# EAGLE design LAMEBOY (EAGLE 7.6.0)

## Sheet 1 of 2
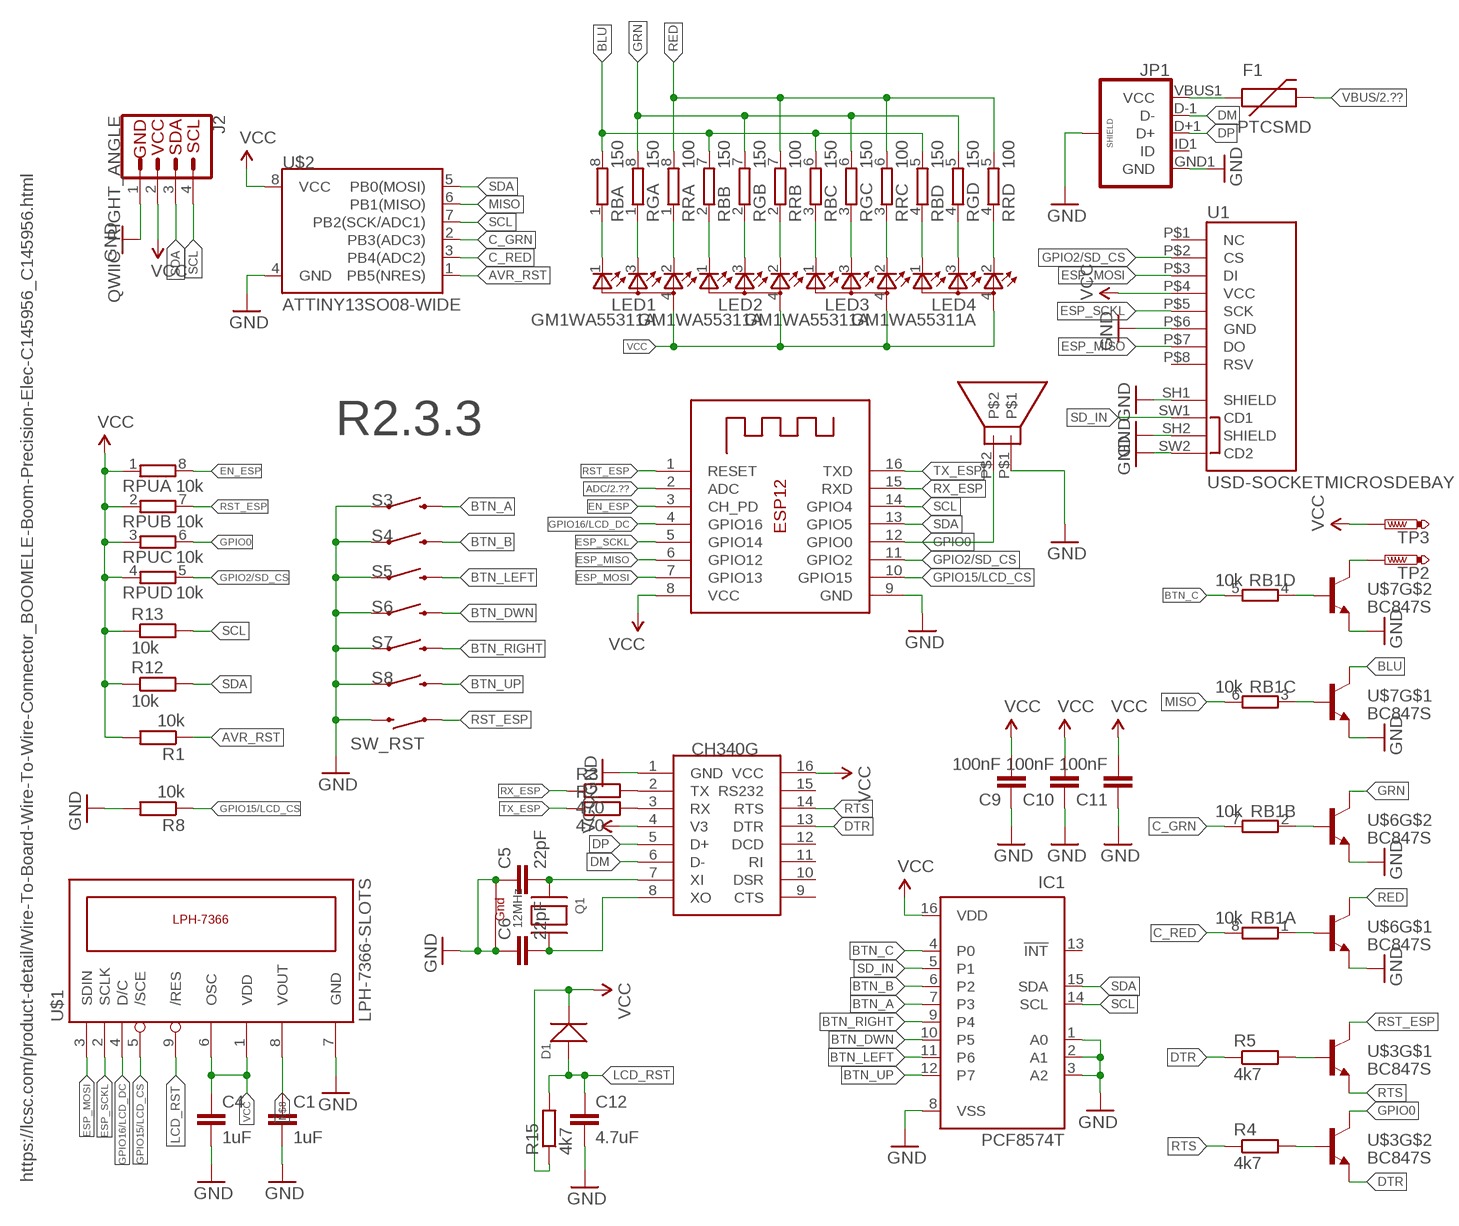
[diagram p0: schematic, sheet 1]

### Parts
C1  1uF  C-EUC0805  [C0805]
C4  1uF  C-EUC0805  [C0805]
C5  22pF  C-EUC0805  [C0805]
C6  22pF  C-EUC0805  [C0805]
C9  100nF  C-EUC0805  [C0805]
C10  100nF  C-EUC0805  [C0805]
C11  100nF  C-EUC0805  [C0805]
C12  4.7uF  C-EUC0805  [C0805]
CH340G  CH340GCH340G  [SOIC16]
D1  DIODE'1N4148-SMD'  [LL-34]
F1  PTCSMD  [PTC-1206]
IC1  PCF8574T  [SO16W]
J2  QWIIC_RIGHT_ANGLE  QWIIC_CONNECTORJS-1MM  [JST04_1MM_RA]
JP1  USB_MICROB_PLUG-IDK  [USB-AB-MICRO-SMD_SLOT]
LED1  GM1WA55311A  [GM1WA55311A]
LED2  GM1WA55311A  [GM1WA55311A]
LED3  GM1WA55311A  [GM1WA55311A]
LED4  GM1WA55311A  [GM1WA55311A]
Q1  12MHz  XTAL-4BIGGER  [NX3225_BIGGER]
R1  10k  R-EU_R0603  [R0603]
R2  470  R-EU_R0603  [R0603]
R3  470  R-EU_R0603  [R0603]
R4  4k7  R-EU_R0603  [R0603]
R5  4k7  R-EU_R0603  [R0603]
R8  10k  R-EU_R0603  [R0603]
R12  10k  R-EU_R0603  [R0603]
R13  10k  R-EU_R0603  [R0603]
R15  4k7  R-EU_R0603  [R0603]
RB  150  4R-N0603-ARC  [0603-ARC]
RB1  10k  4R-N0603-ARC  [0603-ARC]
RG  150  4R-N0603-ARC  [0603-ARC]
RPU  10k  4R-N0603-ARC  [0603-ARC]
RR  100  4R-N0603-ARC  [0603-ARC]
S3  SWITCH-MOMENTARY-2SMD-4  [TACTILE_SWITCH_TALL]
S4  SWITCH-MOMENTARY-2SMD-4  [TACTILE_SWITCH_TALL]
S5  SWITCH-MOMENTARY-2SMD-4  [TACTILE_SWITCH_TALL]
S6  SWITCH-MOMENTARY-2SMD-4  [TACTILE_SWITCH_TALL]
S7  SWITCH-MOMENTARY-2SMD-4  [TACTILE_SWITCH_TALL]
S8  SWITCH-MOMENTARY-2SMD-4  [TACTILE_SWITCH_TALL]
SW_RST  SWITCH-MOMENTARY-2-SMD-1101NE  [TACTILE-SWITCH-1101NE]
TP2  PTR1B1,27  [B1,27]
TP3  PTR1B1,27  [B1,27]
U1  USD-SOCKETMICROSDEBAY  [MICRO-SD-SOCKET-EBAY]
U$1  LPH-7366-SLOTS  [LPH-7366-SLOTS]
U$2  ATTINY13SO08-WIDE  [SO08-EIAJ]
U$3  BC847S  MMDT3904  [SOT363]
U$5  SPEAKERKMTG-1102  [KMTG-1102]
U$6  BC847S  MMDT3904  [SOT363]
U$7  BC847S  MMDT3904  [SOT363]
X1  ESP-12  [ESP-12]

### Nets
ADC: X1.2(ADC) ; also sheet 2
AVR_RST: R1.1 U$2.1(PB5(NRES))
BLU: RB.5 RB.6 RB.7 RB.8 U$7.3(C)
BLUE_LED: LED4.1(CGREEN) RB.4
BTN_A: IC1.7(P3) S3.B2
BTN_B: IC1.6(P2) S4.B2
BTN_C: IC1.4(P0) RB1.5
BTN_DWN: IC1.10(P5) S6.B2
BTN_LEFT: IC1.11(P6) S5.B2
BTN_RIGHT: IC1.9(P4) S7.B2
BTN_UP: IC1.12(P7) S8.B2
C_GRN: RB1.7 U$2.2(PB3(ADC3))
C_RED: RB1.8 U$2.3(PB4(ADC2))
DM: CH340G.6(D-) JP1.D-1(D-)
DP: CH340G.5(D+) JP1.D+1(D+)
DTR: CH340G.13(DTR) R5.1 U$3.1(E)
EN_ESP: RPU.8 X1.3(CH_PD)
ESP_MISO: U1.P$7(DO) X1.6(GPIO12)
ESP_MOSI: U1.P$3(DI) U$1.3(SDIN) X1.7(GPIO13)
ESP_SCKL: U1.P$5(SCK) U$1.2(SCLK) X1.5(GPIO14)
GND: C1.2 C4.2 C5.1 C6.1 C9.1 C10.1 C11.1 C12.2 CH340G.1(GND) IC1.1(A0) IC1.2(A1) IC1.3(A2) IC1.8(VSS) J2.1 JP1.GND1(GND) JP1.P$1(SHIELD) JP1.P$2(SHIELD) JP1.P$3(SHIELD) JP1.P$4(SHIELD) Q1.2(G2) Q1.4(G1) R8.2 S3.A2 S4.A2 S5.A2 S6.A2 S7.A2 S8.A2 SW_RST.P$2 U1.P$6(GND) U1.SH1(SHIELD) U1.SH2(SHIELD) U1.SW2(CD2) U$1.7(GND) U$2.4(GND) U$5.P$1 U$6.1(E) U$6.4(E) U$7.1(E) U$7.4(E) X1.9(GND) ; also sheet 2
GPIO0: RPU.6 U$3.6(C) U$5.P$2 X1.12(GPIO0)
GPIO2/SD_CS: RPU.5 U1.P$2(CS) X1.11(GPIO2)
GPIO15/LCD_CS: R8.1 U$1.5(/SCE) X1.10(GPIO15)
GPIO16/LCD_DC: U$1.4(D/C) X1.4(GPIO16)
GREEN_LED: LED4.3(CBLUE) RG.4
GRN: RG.5 RG.6 RG.7 RG.8 U$6.6(C)
L2_R: LED1.3(CBLUE) RG.1
L3_B: LED1.1(CGREEN) RB.1
L4_G: LED1.2(CRED) RR.1
LCD_RST: C12.1 D1.A(+) R15.2 U$1.9(/RES)
MISO: RB1.6 U$2.6(PB1(MISO))
N$4: LED3.1(CGREEN) RB.3
N$5: LED3.3(CBLUE) RG.3
N$6: LED3.2(CRED) RR.3
N$7: LED2.1(CGREEN) RB.2
N$8: C1.1 U$1.8(VOUT)
N$9: LED2.3(CBLUE) RG.2
N$10: LED2.2(CRED) RR.2
N$11: RB1.1 U$6.5(B)
N$13: RB1.2 U$6.2(B)
N$16: TP2.TP U$7.6(C)
N$17: C5.2 CH340G.7(XI) Q1.1(X1)
N$18: RB1.3 U$7.5(B)
N$19: RB1.4 U$7.2(B)
N$24: C6.2 CH340G.8(XO) Q1.3(X2)
N$25: R5.2 U$3.5(B)
N$26: CH340G.3(RX) R2.2
N$27: CH340G.2(TX) R3.2
N$28: R4.2 U$3.2(B)
RED: RR.5 RR.6 RR.7 RR.8 U$6.3(C)
RED_LED: LED4.2(CRED) RR.4
RST_ESP: RPU.7 SW_RST.P$1 U$3.3(C) X1.1(RESET)
RTS: CH340G.14(RTS) R4.1 U$3.4(E)
RX_ESP: R3.1 X1.15(RXD)
SCL: IC1.14(SCL) J2.4 R13.2 U$2.7(PB2(SCK/ADC1)) X1.14(GPIO4)
SD_IN: IC1.5(P1) U1.SW1(CD1)
SDA: IC1.15(SDA) J2.3 R12.2 U$2.5(PB0(MOSI)) X1.13(GPIO5)
TX_ESP: R2.1 X1.16(TXD)
VBUS: F1.2 ; also sheet 2
VCC: C4.1 C9.2 C10.2 C11.2 CH340G.4(V3) CH340G.16(VCC) D1.C(-) IC1.16(VDD) J2.2 LED1.4(A) LED2.4(A) LED3.4(A) LED4.4(A) R1.2 R12.1 R13.1 R15.1 RPU.1 RPU.2 RPU.3 RPU.4 TP3.TP U1.P$4(VCC) U$1.1(VDD) U$1.6(OSC) U$2.8(VCC) X1.8(VCC) ; also sheet 2
VUSB: F1.1 JP1.VBUS1(VCC)
Unconnected: CH340G.9(CTS) CH340G.10(DSR) CH340G.11(RI) CH340G.12(DCD) CH340G.15(RS232) IC1.13(!INT) JP1.ID1(ID) U1.P$1(NC) U1.P$8(RSV)

### Notes on the sheet
- R2.3.3
- https://lcsc.com/product-detail/Wire-To-Board-Wire-To-Wire-Connector_BOOMELE-Boom-Precision-Elec-C145956_C145956.html

## Sheet 2 of 2
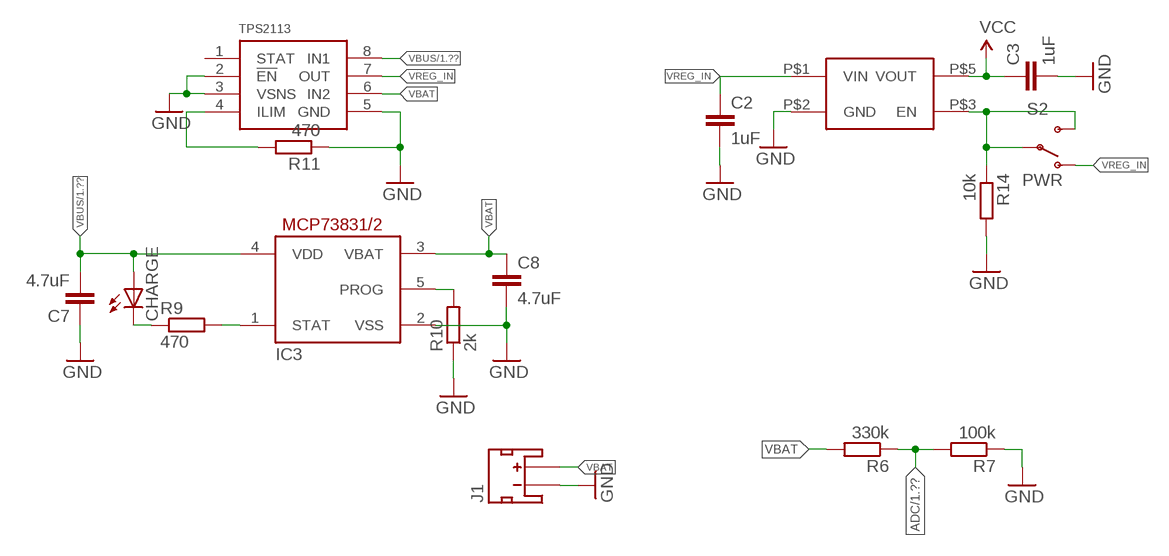
[diagram p1: schematic, sheet 2]

### Parts
C2  1uF  C-EUC0805  [C0805]
C3  1uF  C-EUC0805  [C0805]
C7  4.7uF  C-EUC0805  [C0805]
C8  4.7uF  C-EUC0805  [C0805]
CHARGE  LEDCHARLIE  [CHIPLED_0603_CHARLIE]
IC3  MCP73831  MCP73831/OT  [SOT23-5L]
J1  JST_2MM_MALE  [JST-2-SMD]
R6  330k  R-EU_R0603  [R0603]
R7  100k  R-EU_R0603  [R0603]
R9  470  R-EU_R0603  [R0603]
R10  2k  R-EU_R0603  [R0603]
R11  470  R-EU_R0603  [R0603]
R14  10k  R-EU_R0603  [R0603]
S2  PWR  SWITCH-SPDT-SMD-A  [SWITCH-SPST-SMD-A]
U$4  TPS2113-PW  [TEXAS-PW]
U$9  AP2112KAP2112K  [AP2112]

### Nets
ADC: R6.1 R7.2 ; also sheet 1
GND: C2.2 C3.2 C7.1 C8.2 IC3.2(VSS) J1.1(-) R7.1 R10.1 R11.1 R14.2 U$4.2(!EN) U$4.3(VSNS) U$4.5(GND) U$9.P$2(GND) ; also sheet 1
N$12: IC3.1(STAT) R9.2
N$15: CHARGE.C R9.1
N$20: R11.2 U$4.4(ILIM)
N$21: IC3.5(PROG) R10.2
VBAT: C8.1 IC3.3(VBAT) J1.2(+) R6.2 U$4.6(IN2)
VBUS: C7.2 CHARGE.A IC3.4(VDD) U$4.8(IN1) ; also sheet 1
VCC: C3.1 U$9.P$5(VOUT) ; also sheet 1
VREG_EN: R14.1 S2.2(P) S2.3(S) U$9.P$3(EN)
VREG_IN: C2.1 S2.1(O) U$4.7(OUT) U$9.P$1(VIN)
Unconnected: J1.NC1(PAD1) J1.NC2(PAD2) U$4.1(STAT)

## Library data of the parts
C1-C12 = rcl:C-EU: CAPACITOR, European symbol
CH340G = ch340g:CH340G: USB to TTL RS232 converter
CHARGE = led:LED: LED OSRAM: - CHIPLED LG R971, LG N971, LY N971, LG Q971, LY Q971, LO R971, LY R971 LH N974, LH R974 LS Q976, LO Q976, LY Q976 LO Q996 - Hyper CHIPLED LW Q18S LB Q993, LB Q99A, LB R99A - SideLED LS A670, LO A670, LY A670, LG A670, LP A670 LB A673, LV A673, LT A673, LW A673 LH A674 LY A675 LS A676, LA A676, LO A676, LY A676, LW A676 LS A679, LY A679, LG A679 - Hyper Micro SIDELED® LS Y876, LA Y876, LO Y876, LY Y876 LT Y87S - SmartLED LW L88C, LW L88S LB L89C, LB L89S, LG L890 LS L89K, LO L89K, LY L89K LS L896, LA L896, LO L896, LY L896 - TOPLED LS T670, LO T670, LY T670, LG T670, LP T670 LSG T670, LSP T670, LSY T670, LOP T670, LYG T670 LG T671, LOG T671, LSG T671 LB T673, LV T673, LT T673, LW T673 LH T674 LS T676, LA T676, LO T676, LY T676, LB T676, LH T676, LSB T676, LW T676 LB T67C, LV T67C, LT T67C, LS T67K, LO T67K, LY T67K, LW E67C LS E67B, LA E67B, LO E67B, LY E67B, LB E67C, LV E67C, LT E67C LW T67C LS T679, LY T679, LG T679 LS T770, LO T770, LY T770, LG T770, LP T770 LB T773, LV T773, LT T773, LW T773 LH T774 LS E675, LA E675, LY E675, LS T675 LS T776, LA T776, LO T776, LY T776, LB T776 LHGB T686 LT T68C, LB T68C - Hyper Mini TOPLED® LB M676 - Mini TOPLED Santana® LG M470 LS M47K, LO M47K, LY M47K Source: http://www.osram.convergy.de LUXEON: - LUMILED® LXK2-PW12-R00, LXK2-PW12-S00, LXK2-PW14-U00, LXK2-PW14-V00 LXK2-PM12-R00, LXK2-PM12-S00, LXK2-PM14-U00 LXK2-PE12-Q00, LXK2-PE12-R00, LXK2-PE12-S00, LXK2-PE14-T00, LXK2-PE14-U00 LXK2-PB12-K00, LXK2-PB12-L00, LXK2-PB12-M00, LXK2-PB14-N00, LXK2-PB14-P00, LXK2-PB14-Q00 LXK2-PR12-L00, LXK2-PR12-M00, LXK2-PR14-Q00, LXK2-PR14-R00 LXK2-PD12-Q00, LXK2-PD12-R00, LXK2-PD12-S00 LXK2-PH12-R00, LXK2-PH12-S00 LXK2-PL12-P00, LXK2-PL12-Q00, LXK2-PL12-R00 Source: www.luxeon.com KINGBRIGHT: KA-3528ASYC Source: www.kingbright.com
D1 = Seeed-OPL-Diode:DIODE*
F1 = SparkFun-PowerIC:PTC: Resettable Fuse PTC Resettable Fuse. Spark Fun Electronics SKU : COM-08357; PROD_ID: RES-11150
IC1 = micro-philips:PCF8574: I2C-Bus Remote 8-bit I/O expander http://www.semiconductors.philips.com/acrobat_download/datasheets/PCF8574_4.pdf; MPN: PCF8574T/3,512; OC_FARNELL: 1201255; OC_NEWARK: 70R6870
IC3 = adafruit:MCP73831: MCP73831/2 Miniature Single-Cell, Fully Integrated Li-Ion, Li-Polymer Charge Management Controllers. Nice and small simple lipoly charge controller, with adjustable current and status output (LED) http://www.ladyada.net/library/pcb/eaglelibrary.html
J1 = SparkFun-Connectors:JST_2MM_MALE: Mates to single-cell LiPo batteries. CONN-08352; PROD_ID: CONN-08352
J2 = SparkFun-Connectors_2021_05_21:QWIIC_CONNECTOR: SparkFun I2C Standard Qwiic Connector An SMD 1mm pitch JST connector makes it easy and quick (get it? Qwiic?) to connect I2C devices to each other. The Qwiic system <http://www.sparkfun.com/qwiic> enables fast and solderless connection between popular platforms and various sensors and actuators. We carry 200mm <https://www.sparkfun.com/products/14204>, 100mm <https://www.sparkfun.com/products/14205>, 50mm <https://www.sparkfun.com/products/14206>, and breadboard friendly <https://www.sparkfun.com/products/14207> Qwiic cables. We also offer 10 pcs strips <https://www.sparkfun.com/products/14323> the SMD connectors.; PROD_ID: CONN-13694
JP1 = SparkFun-Connectors:USB_MICROB_PLUG: USB Micro-B connectors Some male, some female. Watch your step!
LED1-LED4 = led:GM1WA55311A: Chip LED RGB Source: http://document.sharpsma.com/files/GM1WA55311A_SS.pdf
Q1 = adafruit:XTAL-4: Classic 4-pin 3.2 x 2.5mm crystal
R1-R15 = rcl:R-EU_: RESISTOR, European symbol
RB RB1 RG RPU RR = resistor-dil:4R-N: Array Chip Resistor Source: RS Component / Phycomp; OC_FARNELL: unknown; OC_NEWARK: unknown
S2 = SparkFun-Electromechanical:SWITCH-SPDT: SPDT Switch Simple slide switch, Spark Fun Electronics SKU : COM-00102 DPDT SMT slide switch, AYZ0202, SWCH-08179
S3-S8 = SparkFun-Electromechanical:SWITCH-MOMENTARY-2: Various NO switches- pushbuttons, reed, etc; PROD_ID: SWCH-11966
SW_RST = SparkFun-Electromechanical:SWITCH-MOMENTARY-2: Various NO switches- pushbuttons, reed, etc
TP2 TP3 = testpad:PTR1: TEST PIN
U1 = SparkFun-Connectors:USD-SOCKET: microSD Socket Push-push type uSD socket. Schematic element and footprint production proven. Spark Fun Electronics SKU : PRT-00127. tDoc lines correctly indicate media card edge positions when inserting (unlocked, locked, depressed). NOTE: CD1 and CD2 are connected internally
U$1 = lph-7366:LPH-7366-SLOTS
U$2 = SparkFun-DigitalIC:ATTINY13: Atmel 8-pin 1kB flash uC
U$3 U$6 U$7 = SparkFun-DiscreteSemi:MMDT3904: Dual NPN transistor
U$4 = TPS2113:TPS2113-PW
U$5 = KMTG-1002:SPEAKER
U$9 = TPS2113:AP2112K
X1 = adafruit:ESP-12

## Board
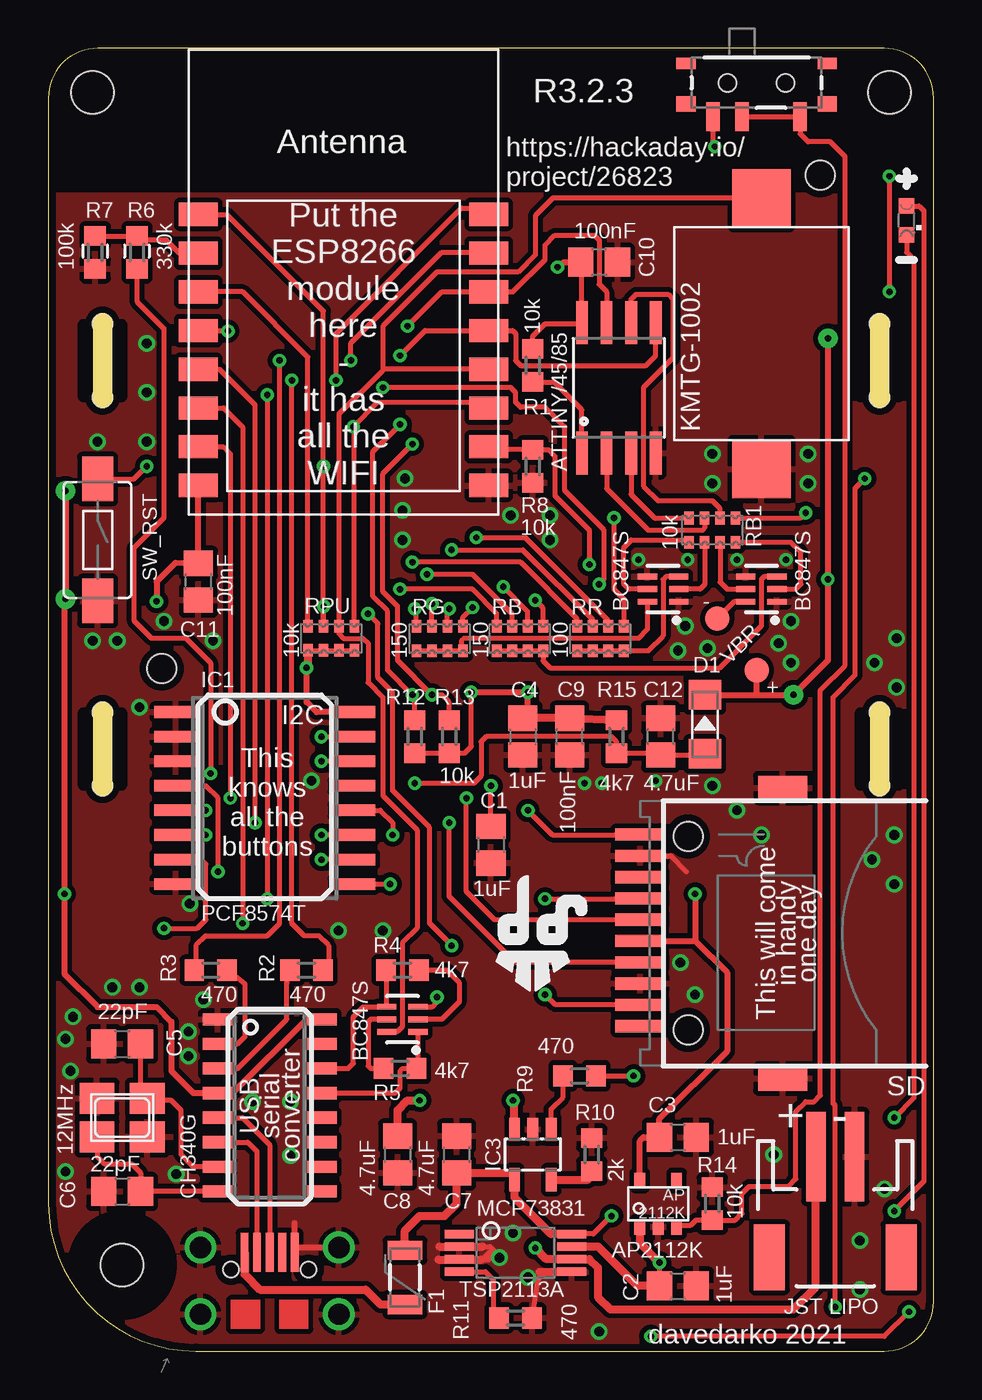
[diagram p2: board, top side]
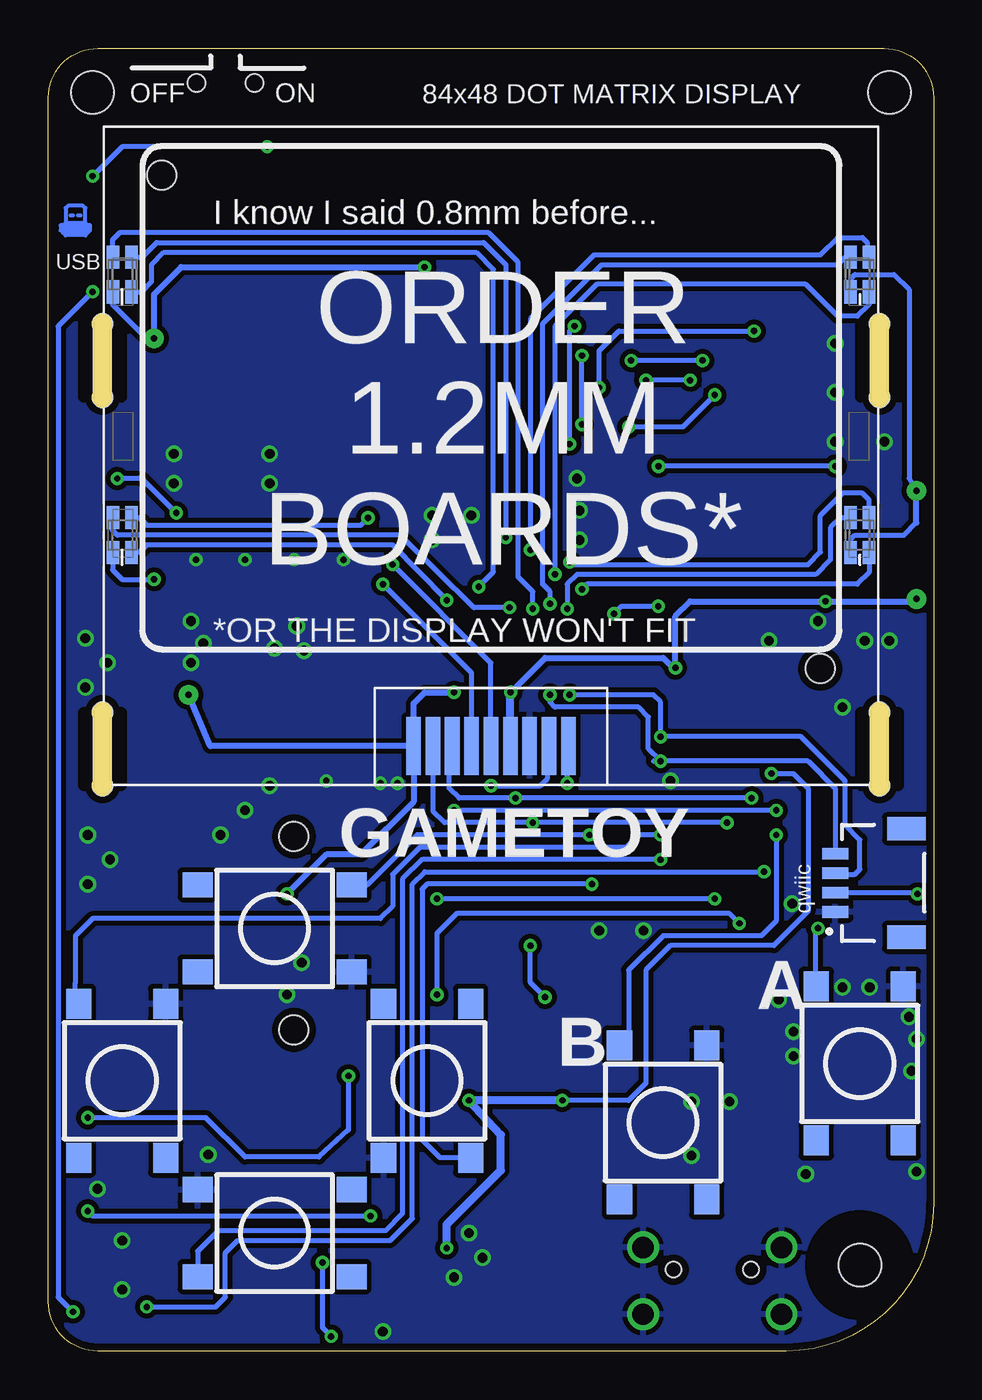
[diagram p3: board, bottom side, seen from below]

Size 45.72 x 67.31 mm. Coordinates in mm from the lower left corner, seen from the top.
Outline: 0,64.77 0,7.62 arc90 7.62,0 43.18,0 arc90 45.72,2.54 45.72,64.77 arc90 43.18,67.31 2.54,67.31 arc90 0,64.77
Copper layers (1*16): Top 0.0356mm / dielectric 1.5011mm / Bottom 0.0356mm
Design rules "LaenPCBOrder *": minimum track width 6mil, minimum drill 13mil, track to track 6mil, track to pad 6mil, pad to pad 6mil, via to via 6mil, smd to smd 6mil, copper to edge 15mil, drill to drill 6mil, minimum pad ring 7mil, minimum via ring 7mil, stop-mask expansion 3mil, vias tented up to drill 200mil, thermal gap 10mil
Holes 2.2 mm at 3.81,4.45 2.29,65.02 43.43,65.02
tRestrict: area 1.3,1.9 to 6.3,6.9
bRestrict: area 1.3,1.9 to 6.3,6.9

### Footprints (pad centres in the part's own frame; a part is rotated, then mirrored left to right if it is on the bottom)
C0805 = smd 1.3 x 1.5: 1 -0.95,0; 2 0.95,0
SOIC16 = smd 0.635 x 1.524: 1 -4.445,-2.695; 2 -3.175,-2.695; 3 -1.905,-2.695; 4 -0.635,-2.695; 5 0.635,-2.695; 6 1.905,-2.695; 7 3.175,-2.695; 8 4.445,-2.695; 9 4.445,2.695; 10 3.175,2.695; 11 1.905,2.695; 12 0.635,2.695; 13 -0.635,2.695; 14 -1.905,2.695; 15 -3.175,2.695; 16 -4.445,2.695
CHIPLED_0603_CHARLIE = smd 0.8 x 0.8: A 0,-0.75; C 0,0.75
LL-34 = smd 1.524 x 1.676: A -1.524,0; C 1.524,0
PTC-1206 = smd 1 x 1.8: 1 -1.4,0; 2 1.4,0
SO16W = smd 0.6 x 2.2: 1 -4.445,-4.6; 2 -3.175,-4.6; 3 -1.905,-4.6; 4 -0.635,-4.6; 5 0.635,-4.6; 6 1.905,-4.6; 7 3.175,-4.6; 8 4.445,-4.6; 9 4.445,4.6; 10 3.175,4.6; 11 1.905,4.6; 12 0.635,4.6; 13 -0.635,4.6; 14 -1.905,4.6; 15 -3.175,4.6; 16 -4.445,4.6
SOT23-5L = smd 0.55 x 1.2: 1 -0.95,-1.3; 2 0,-1.3; 3 0.95,-1.3; 4 0.95,1.3; 5 -0.95,1.3
JST-2-SMD = smd 1 x 4.6: 1 -1,-3.7; 2 1,-3.7 | smd 1.6 x 3.4: NC1 -3.4,1.5; NC2 3.4,1.5
JST04_1MM_RA = smd 0.6 x 1.35: 1 -1.5,0; 2 -0.5,0; 3 0.5,0; 4 1.5,0 | smd 1.2 x 2: NC1 2.8,-3.675; NC2 -2.8,-3.675
USB-AB-MICRO-SMD_SLOT = smd 2 x 0.4: D+1 3.2,0; D-1 3.2,0.65; GND1 3.2,-1.3; ID1 3.2,-0.65; VBUS1 3.2,1.3 | drill 1.1: P$1 0,3.575; P$2 0,-3.575; P$3 3.45,-3.575; P$4 3.45,3.575 | hole 0.8: 2.3,2; 2.3,-2
GM1WA55311A = smd 0.65 x 1.2: 1 -0.475,0.9; 2 -0.475,-0.9; 3 0.475,-0.9; 4 0.475,0.9
NX3225_BIGGER = smd 1.8 x 1.6: 1 -1.3,-1; 2 1.3,-1; 3 1.3,1; 4 -1.3,1
R0603 = smd 1 x 1.1: 1 -0.85,0; 2 0.85,0
0603-ARC = smd 0.5 x 0.65: 1 -1.2,-0.625; 2 -0.4,-0.625; 3 0.4,-0.625; 4 1.2,-0.625; 5 1.2,0.625; 6 0.4,0.625; 7 -0.4,0.625; 8 -1.2,0.625
SWITCH-SPST-SMD-A = smd 0.7 x 1.5: 1 -2.25,-1.75; 2 -0.75,-1.75; 3 2.25,-1.75 | smd 1 x 0.6: GND1 -3.65,1; GND3 3.65,1 | smd 1 x 0.8: GND2 -3.65,-1.1; GND4 3.65,-1.1 | hole 0.9: -1.5,0; 1.5,0
TACTILE_SWITCH_TALL = smd 1.55 x 1.3: A1 -3.975,-2.25; A2 3.975,-2.25; B1 -3.975,2.25; B2 3.975,2.25
TACTILE-SWITCH-1101NE = smd 2.3 x 1.6: P$1 -3.15,0; P$2 3.15,0
B1,27 = smd 1.27 x 1.27: TP 0,0
MICRO-SD-SOCKET-EBAY = smd 0.63 x 2.54: P$1 -2.9,-5; P$2 -1.8,-5; P$4 0.4,-5; P$5 1.5,-5; P$6 2.6,-5; P$7 3.7,-5; P$8 4.8,-5; SW1 -5.1,-5; SW2 -4,-5 | smd 0.635 x 2.54: P$3 -0.7,-5 | smd 1.27 x 2.54: SH1 -7.5,2.37; SH2 7.5,2.37 | hole 1.5: -5,-2.52; 5,-2.52
LPH-7366-SLOTS = smd 0.75 x 3: 1 4,17; 2 3,17; 3 2,17; 4 1,17; 5 0,17; 6 -1,17; 7 -2,17; 8 -3,17; 9 -4,17 | hole 1.5: -17,13; 17,-12.5 | hole 1.016: -20.066,19.05; -20.066,15.24; 20.066,19.05; 20.066,15.24; 20.066,-1.016; 20.066,-4.826; -20.066,-1.016; -20.066,-4.826
SO08-EIAJ = smd 0.61 x 2.21: 1 -1.905,-3.378; 2 -0.635,-3.378; 3 0.635,-3.378; 4 1.905,-3.378; 5 1.905,3.353; 6 0.635,3.353; 7 -0.635,3.353; 8 -1.905,3.353
SOT363 = smd 0.3 x 0.99: 1 -0.65,-0.8; 2 0,-0.8; 3 0.65,-0.8; 4 0.65,0.81; 5 0,0.81; 6 -0.65,0.81
TEXAS-PW = smd 1.5 x 0.45: 1 -2.9,0.975; 2 -2.9,0.325; 3 -2.9,-0.325; 4 -2.9,-0.975; 5 2.9,-0.975; 6 2.9,-0.325; 7 2.9,0.325; 8 2.9,0.975
KMTG-1102 = smd 3 x 3: P$1 -7,0; P$2 7,0
AP2112 = smd 0.55 x 0.8: P$1 0.95,1.2; P$2 0,1.2; P$3 -0.95,1.2; P$4 -0.95,-1.2; P$5 0.95,-1.2
ESP-12 = smd 2 x 1.2: 1 -7.5,4.5; 2 -7.5,2.5; 3 -7.5,0.5; 4 -7.5,-1.5; 5 -7.5,-3.5; 6 -7.5,-5.5; 7 -7.5,-7.5; 8 -7.5,-9.5; 9 7.5,-9.5; 10 7.5,-7.5; 11 7.5,-5.5; 12 7.5,-3.5; 13 7.5,-1.5; 14 7.5,0.5; 15 7.5,2.5; 16 7.5,4.5

### Placement (x,y rotation side)
C1  22.86,26.16 270 top
C2  32.51,3.37 0 top
C3  32.51,11.05 0 top
C4  24.51,31.75 270 top
C5  3.81,15.88 0 top
C6  3.81,8.26 0 top
C7  21.08,10.16 270 top
C8  18.03,10.16 270 top
C9  26.92,31.75 90 top
C10  28.45,56.26 180 top
C11  7.75,39.75 90 top
C12  31.62,31.75 90 top
CH340G  11.43,12.7 270 top
CHARGE  44.32,58.42 180 top
D1  33.91,32.38 90 top
F1  18.41,3.81 90 top
IC1  11.18,28.57 270 top
IC3  25.02,10.16 180 top
J1  40.64,6.35 180 top
J2  5.08,24.19 90 bottom
JP1  11.43,1.91 90 top
LED1  41.91,42.16 180 bottom
LED2  41.91,55.63 180 bottom
LED3  3.81,55.63 180 bottom
LED4  3.81,42.16 180 bottom
Q1  3.81,12.06 180 top
R1  25.02,50.93 90 top
R2  13.34,19.68 180 top
R3  8.38,19.68 0 top
R4  18.29,19.68 0 top
R5  18.16,14.61 180 top
R6  4.57,56.77 270 top
R7  2.41,56.77 90 top
R8  25.02,45.72 270 top
R9  27.43,14.22 180 top
R10  28.07,10.16 270 top
R11  24.13,1.71 180 top
R12  18.92,31.75 90 top
R13  20.7,31.75 90 top
R14  34.29,7.62 90 top
R15  29.34,31.75 270 top
RB  24.36,36.82 180 top
RB1  34.29,42.42 0 top
RG  20.21,36.82 180 top
RPU  14.61,36.83 0 top
RR  28.51,36.82 180 top
S2  36.58,65.53 0 top
S3  3.81,14.86 90 bottom
S4  13.97,11.81 90 bottom
S5  41.91,13.97 90 bottom
S6  34.04,6.1 180 bottom
S7  26.16,13.97 270 bottom
S8  34.04,21.84 0 bottom
SW_RST  2.54,41.91 270 top
TP2  34.54,37.85 0 top
TP3  36.58,35.18 0 top
U1  35.56,21.59 270 top
U$1  22.86,48.26 180 bottom
U$2  29.46,49.78 0 top
U$3  18.29,17.14 90 top
U$4  24.13,5.08 0 top
U$5  36.83,52.58 90 top
U$6  31.75,39.37 90 top
U$7  36.83,39.37 90 top
U$9  31.5,7.62 180 top
U$11  [DAVEDARKO2_LOGO]  25.02,20.83 0 top
U$13  [DAVEDARKO_GOLD]  34.04,12.83 0 bottom
X1  15.24,54.23 0 top

### Tracks (layer width: path | path; a pad name or v marks a point on that pad's centre or on a via)
ADC
  Top 0.254: R7.2 R6.1 5.16,57.4 6.1,57.4 6.77,56.73 X1.2
AVR_RST
  Top 0.254: U$2.1 27.56,48.64 26.16,50.04 25.06,50.04 R1.1
BLU
  Top 0.254: RB.5 RB.6 RB.7 RB.8 25.56,35.66 25.91,35.31 34.67,35.31 36.83,37.47 36.83,39.88 36.97,40.02 U$7.3
BLUE_LED  (via drill 0.33 pad 0.64)
  Top 0.254: RB.4 23.16,38.12 21.91,39.37 v18.16,39.37
  Bottom 0.254: LED4.1 3.34,40.23 3.94,39.62 17.91,39.62 v18.16,39.37
BTN_A  (via drill 0.33)
  Top 0.254: v5.97,21.84 7.68,21.84 8.13,22.29 8.13,25.15 7.87,25.4 IC1.7
  Bottom 0.254: S3.B2 6.1,19.25 6.1,21.72 v5.97,21.84
BTN_B  (via drill 0.33)
  Top 0.254: IC1.6 v8.13,26.67
  Bottom 0.254: v8.13,26.67 8.13,22.23 8.89,21.46 13.97,21.46 15.75,19.68 15.75,16.13 S4.B2 16.26,15.7
BTN_C  (via drill 0.33)
  Top 0.254: v8.76,24.77 8.76,28.57 8.13,29.21 IC1.4 | v40.64,2.29 40.64,12.7 40.51,12.83 40.51,33.78 41.66,34.92 41.66,44.58 v42.16,45.09 | RB1.5 38.85,43.04 v39.12,43.31
  Bottom 0.254: v40.64,2.29 37.08,2.29 36.58,2.79 36.58,5.08 35.94,5.71 28.07,5.71 26.92,6.86 26.92,24.13 26.29,24.77 v8.76,24.77 | v39.12,43.31 40.89,45.09 v42.16,45.09
BTN_DWN  (via drill 0.33)
  Top 0.254: IC1.10 v14.1,25.4
  Bottom 0.254: v14.1,25.4 26.42,25.4 27.43,24.38 27.43,7.11 28.32,6.22 36.96,6.22 38.01,5.17 S6.B2
BTN_LEFT  (via drill 0.33)
  Top 0.254: IC1.11 v14.1,26.67
  Bottom 0.254: v14.1,26.67 15.24,26.67 15.88,26.04 26.54,26.04 27.94,24.64 27.94,22.99 28.57,22.35 43.43,22.35 44.32,21.46 44.32,19.05 44.32,18.11 | 44.32,18.11 44.32,17.37 | S5.B2 44.32,18.11
BTN_RIGHT  (via drill 0.33)
  Top 0.254: IC1.9 v17.65,24.13
  Bottom 0.254: v17.65,24.13 26.16,24.13 26.42,23.88 26.42,10.92 25.49,9.99 S7.B2
BTN_UP  (via drill 0.33)
  Top 0.254: IC1.12 17.14,27.94 17.78,27.3 v17.78,26.67
  Bottom 0.254: v17.78,26.67 26.67,26.67 29.25,24.09 S8.B2
C_GRN
  Top 0.254: U$2.2 28.83,44.58 30.99,42.42 33.78,42.42 33.89,42.53 RB1.7
C_RED
  Top 0.254: U$2.3 30.1,44.26 31.3,43.05 33.08,43.05 RB1.8
DM
  Top 0.254: CH340G.6 10.29,10.79 10.78,10.3 JP1.D-1
DP
  Top 0.254: CH340G.5 10.03,12.06 11.43,10.67 JP1.D+1
DTR
  Top 0.254: CH340G.13 17.91,13.34 18.16,13.59 18.16,14.48 18.29,14.61 R5.1 19.09,14.9 U$3.1
EN_ESP
  Top 0.254: RPU.8 13.4,51.37 10.03,54.74 8.13,54.74 X1.3
ESP_MISO  (via drill 0.33)
  Top 0.254: X1.6 9.06,48.73 10.03,47.75 v10.03,22.1 | U1.P$7 26.18,17.89 v25.65,18.41
  Bottom 0.254: v10.03,22.1 10.54,22.61 24.64,22.61 25.65,21.59 v25.65,18.41
ESP_MOSI  (via drill 0.33, 0.33 pad 0.61)
  Top 0.254: X1.7 9.02,46.73 9.4,46.35 v9.4,28.57 | U1.P$3 23.05,22.29 21.59,23.75 v21.59,28.57
  Bottom 0.254: v9.4,28.57 v21.59,28.57 24.51,28.57 25.02,29.08 25.02,31.1 U$1.3 24.89,31.23
ESP_SCKL  (via drill 0.33, 0.33 pad 0.61)
  Top 0.254: X1.5 8.83,50.73 10.67,48.9 v10.67,27.3 | v20.7,27.3 20.7,23.5 24.11,20.09 U1.P$5
  Bottom 0.254: v10.67,27.3 v20.7,27.3 25.27,27.3 25.86,27.89 U$1.2
GND  (via drill 0.33, 0.5)
  Top 0.254: U1.SW2 32.13,25.59 32.96,24.77 | R11.1 25.3,3.71 25.65,4.06 26.99,4.06 U$4.5 | U$4.2 20.58,5.41 20.57,5.4 | 22.42,5.4 22.8,5.4 23.11,5.08 | 23.11,5.08 22.73,5.08 22.38,4.73 22.77,4.73 23.11,5.08 | JP1.GND1 12.73,5.36
  Top 0.305: JP1.P$3 12.73,5.36 12.73,5.08 12.7,5.08 12.7,6.6
  Top 0.406: 20.19,5.4 20.57,5.4 22.42,5.4 | 20.16,4.73 22.38,4.73 | 25.37,4.1 27.59,4.1
  other vias: 33.02,40.89 30.48,40.89 35.56,40.89 38.1,40.89 32.51,36.2 32.89,37.47 34.04,36.32 4.7,33.27 2.29,36.7 34.29,44.83 39.24,44.83 39.24,46.35 42.67,35.56 43.81,34.29 43.81,36.83 18.41,45.09 18.29,41.91 43.69,26.67 43.69,24.13 12.51,12.89 12.51,10.1 8,18.16 3.3,18.8 4.7,18.8 32.64,20.07 33.4,18.41 18.29,43.43 25.91,43.18 23.88,43.18 25.91,41.91 7.24,15.24 7.24,16.51 24,6.1 23.3,4.83 28.45,1.02 24.77,3.81 13.59,29.46 14.99,21.72 17.27,21.72 1.27,17.27 1.14,14.48 0.89,16.13 0.89,9.27 6.6,9.14 10.54,12.89 34.29,46.35 7.3,23.11 5.08,52.07 5.08,49.53 5.08,46.99 2.54,46.99 3.56,36.7 8.51,36.7 5.97,37.72 42.55,25.4 38.35,37.72 38.35,35.56 37.72,36.58 34.29,29.21 35.56,27.94 36.83,26.67 41.91,5.71 41.91,3.17 43.18,8.38 37.47,10.16 27.69,29.34 28.57,29.34 31.37,29.46
  pour Bottom (isolate 0.254): 53.34,59.77 -3.05,59.77 -3.05,-5.08 53.34,-5.08
  pour Top (isolate 0.254): 54.61,59.69 -4.32,59.69 -4.32,-2.54 54.61,-2.54
GPIO0
  Top 0.152: 17.49,16.51 U$3.6
  Top 0.254: 17.49,16.51 18.03,16.51 18.29,16.76 18.29,21.08 19.05,21.84 19.05,26.92 17.27,28.7 17.27,33.78 16.51,34.54 16.51,36.58 16.26,36.83 15.24,36.83 15.01,37.06 RPU.6 15.01,48.41 17.27,50.67 | U$5.P$2 26.05,59.58 25.15,58.67 25.15,56.64 24.26,55.75 20.07,55.75 17.27,52.96 17.27,50.67 | X1.12 17.33,50.73 17.27,50.67
GPIO2/SD_CS  (via drill 0.33)
  Top 0.254: X1.11 22.91,49.02 17.02,49.02 v15.75,47.75 15.8,47.7 RPU.5 | v11.3,49.4 v11.3,23.37 | v25.65,23.37 29.27,23.37 U1.P$2
  Bottom 0.254: v11.3,23.37 v25.65,23.37 | v11.3,49.4 12.95,47.75 v15.75,47.75
GPIO15/LCD_CS  (via drill 0.33 pad 0.61)
  Top 0.254: v27.94,40.64 27.94,42.42 26.16,44.2 26.16,46.23 25.82,46.57 R8.1 22.9,46.57 X1.10
  Bottom 0.254: U$1.5 22.86,35.56 v27.94,40.64
GPIO16/LCD_DC  (via drill 0.33)
  Top 0.254: v28.45,39.62 28.7,39.88 28.7,42.42 26.67,44.45 26.67,47.75 25.65,48.77 24.38,48.77 24.13,49.02 24.13,49.53 23.88,49.78 v17.27,49.78 | v9.27,52.7 7.76,52.7 X1.4
  Bottom 0.254: U$1.4 23.86,35.04 v28.45,39.62 | v17.27,49.78 17.27,51.69 16.26,52.7 v9.27,52.7
GREEN_LED  (via drill 0.33 pad 0.64)
  Top 0.254: RG.4 19.01,38.27 v18.92,38.35
  Bottom 0.254: LED4.3 4.83,43.05 5.33,42.55 5.33,40.89 6.1,40.13 18.41,40.13 18.92,39.62 v18.92,38.35
GRN
  Top 0.254: RG.5 RG.6 RG.7 RG.8 21.34,36.27 21.34,36.7 21.46,36.83 30.48,36.83 30.94,37.29 U$6.6
L2_R  (via drill 0.33 pad 0.64)
  Top 0.254: RG.1 21.41,37.92 v21.91,38.42
  Bottom 0.254: v21.91,38.42 23.75,38.42 27.56,42.16 42.16,42.16 42.42,42.42 42.42,43.09 LED1.3
L3_B  (via drill 0.33 pad 0.64)
  Top 0.254: RB.1 25.56,38.39 v25.15,38.8
  Bottom 0.254: v25.15,38.8 25.21,38.86 27.94,41.66 40.64,41.66 41.03,41.26 LED1.1
L4_G  (via drill 0.33 pad 0.64)
  Top 0.254: v29.21,43.05 29.21,39.37 29.72,38.86 RR.1
  Bottom 0.254: LED1.2 41.03,43.06 40.64,42.67 29.59,42.67 v29.21,43.05
LCD_RST  (via drill 0.33)
  Top 0.254: v18.92,29.34 21.97,29.34 22.35,29.72 22.35,31.5 22.61,31.75 29.08,31.75 29.34,31.5 R15.2 31.52,30.9 C12.1 33.85,30.8
  Top 0.406: 33.85,30.8 D1.A
  Bottom 0.152: 18.92,31.2 U$1.9
  Bottom 0.254: v18.92,29.34 18.92,31.2
MISO
  Top 0.254: U$2.6 30.1,54.36 30.35,54.61 32,54.61 32.26,54.36 32.26,51.31 30.73,49.78 30.73,44.7 31.5,43.94 34.29,43.94 34.67,43.56 34.67,43.06 RB1.6
N$1
  Bottom 0.203: 43.94,59.18 44.7,59.18 44.83,59.05 44.83,58.29 43.81,58.29 43.81,59.05 43.94,59.18
N$2
  Bottom 0.203: 44.07,58.67 44.2,58.67
N$3
  Bottom 0.203: 44.45,58.67 44.58,58.67
N$4  (via drill 0.33 pad 0.64)
  Top 0.254: RB.3 23.96,38.08 21.91,40.13 v19.56,40.13
  Bottom 0.254: LED3.1 3.34,54.07 3.94,53.47 4.95,53.47 6.6,55.12 17.4,55.12 19.56,52.96 v19.56,40.13
N$5  (via drill 0.33 pad 0.64)
  Top 0.254: RG.3 v19.81,38.61
  Bottom 0.254: v19.81,38.61 19.81,39.24 20.19,39.62 20.19,53.09 17.14,56.13 4.95,56.13 4.57,56.52 4.3,56.52 LED3.3
N$6  (via drill 0.33 pad 0.64)
  Top 0.254: RR.3 28.11,37.8 24.51,41.4 v20.83,41.4
  Bottom 0.254: v20.83,41.4 20.83,53.34 17.53,56.64 5.84,56.64 4.95,57.53 3.68,57.53 3.43,57.28 3.43,56.62 LED3.2
N$7  (via drill 0.33 pad 0.64)
  Top 0.254: RB.2 24.76,38.22 v23.5,39.5
  Bottom 0.254: v23.5,39.5 22.73,40.26 22.73,55.88 23.62,56.77 39.75,56.77 40.39,56.13 40.39,55.24 40.91,54.73 LED2.1
N$8  (via drill 0.33)
  Top 0.254: C1.1 v22.86,29.21
  Bottom 0.254: v22.86,29.21 20.32,29.21 19.94,29.59 19.94,31.18 U$1.8
N$9  (via drill 0.33 pad 0.64)
  Top 0.254: RG.2 20.61,38.19 v20.7,38.35
  Bottom 0.254: v20.7,38.35 20.7,39.24 21.46,40.01 21.46,56.26 22.99,57.78 42.04,57.78 42.42,57.4 42.42,56.56 LED2.3
N$10  (via drill 0.33 pad 0.64)
  Top 0.254: v22.1,42.04 24.64,42.04 28.91,37.76 RR.2
  Bottom 0.254: LED2.2 40.88,56.52 40.13,57.28 23.24,57.28 22.1,56.13 v22.1,42.04
N$11
  Top 0.254: U$6.5 29.97,39.37 29.72,39.62 29.72,41.53 30.1,41.91 32.97,41.91 RB1.1
N$12
  Top 0.254: IC3.1 25.97,12.51 26.58,13.12 R9.2
N$13
  Top 0.254: RB1.2 33.89,39.6 33.66,39.37 U$6.2
N$14
  Bottom 0.152: 44.83,57.91 44.83,57.66
  Bottom 0.203: 43.69,58.04 44.96,58.04 44.96,57.78 43.69,57.78 43.69,57.91 44.83,57.91 | 43.56,57.91 43.56,58.17 45.09,58.17 45.09,57.91 44.83,57.66 43.81,57.66 43.56,57.91
N$15  (via drill 0.33)
  Top 0.254: CHARGE.C 44.32,56.77 44.7,56.39 44.7,13.08 v43.69,12.06 | R9.1 v30.23,14.22
  Bottom 0.254: v30.23,14.22 30.23,11.43 31.75,10.03 35.56,10.03 37.59,12.06 v43.69,12.06
N$16
  Top 0.254: U$7.6 35.42,38.72 TP2.TP
N$17
  Top 0.254: CH340G.7 7.49,9.53 6.86,10.16 6.86,12.45 6.35,12.95 5.22,12.95 Q1.1 4.76,13.41 C5.2
N$18
  Top 0.254: RB1.3 34.69,39.73 35.05,39.37 U$7.5
N$19
  Top 0.254: U$7.2 38.61,39.37 38.86,39.62 38.86,41.27 38.35,41.78 RB1.4
N$20
  Top 0.254: U$4.4 22.57,4.11 22.99,3.68 22.99,1.3 R11.2
N$21
  Top 0.406: IC3.5 27.86,8.86 R10.2
N$24
  Top 0.254: CH340G.8 C6.2 4.76,9.21 4.32,9.65 2.92,9.65 2.54,10.03 2.54,11.04 Q1.3
N$25
  Top 0.254: U$3.5 16.64,17.14 16.51,17.02 16.51,14.73 16.64,14.61 R5.2
N$26
  Top 0.254: CH340G.3 9.78,14.61 12.32,17.14 12.32,19.02 R2.2
N$27
  Top 0.254: CH340G.2 9.78,15.88 10.16,16.26 10.16,18.95 R3.2
N$28
  Top 0.254: R4.2 20.57,19.68 21.21,19.05 21.21,18.03 20.32,17.14 U$3.2
RED
  Top 0.254: RR.5 RR.6 RR.7 RR.8 30.98,36.19 31.75,36.96 31.75,39.88 31.89,40.02 U$6.3
RED_LED  (via drill 0.33 pad 0.64)
  Top 0.254: RR.4 27.31,37.84 24.38,40.77 v18.8,40.77
  Bottom 0.254: v18.8,40.77 18.67,40.64 6.48,40.64 5.84,41.27 5.84,43.18 4.7,44.32 3.68,44.32 3.34,43.98 LED4.2
RST_ESP  (via drill 0.33, 0.33 pad 0.64)
  Top 0.254: X1.1 9.22,58.73 14.21,53.74 v14.21,45.72 RPU.7 14.22,37.44 v14.22,38.48 | v20.83,20.95 19.68,22.1 19.68,27.05 17.78,28.96 17.78,34.04 17.02,34.8 17.02,37.59 v16.51,38.1 | U$3.3 19.83,17.8 20.07,18.03 v20.07,18.29 | SW_RST.P$1 4.42,45.06 v5.08,45.72
  Bottom 0.254: v20.07,18.29 20.83,19.05 v20.83,20.95 | v14.22,38.48 16.13,38.48 v16.51,38.1 | v5.08,45.72 v14.21,45.72
RTS
  Top 0.254: CH340G.14 15.49,14.61 15.75,14.86 15.75,17.27 16.26,17.78 17.34,17.78 U$3.4 17.48,19.32 R4.1
RX_ESP  (via drill 0.33 pad 0.64)
  Top 0.254: v11.94,51.18 11.94,22.1 11.3,21.46 8.13,21.46 7.62,20.95 7.62,19.72 R3.1 | v15.62,51.18 15.62,52.07 20.32,56.77 22.32,56.77 X1.15
  Bottom 0.254: v11.94,51.18 v15.62,51.18
SCL  (via drill 0.33)
  Top 0.254: v14.1,30.48 IC1.14 | v18.8,46.86 17.27,45.34 17.27,39.24 18.03,38.48 18.03,35.69 v19.81,33.91 20.32,33.91 20.7,33.53 R13.2 | v18.54,52.96 20.32,54.74 22.35,54.74 22.73,55.12 X1.14 24,54.73 25.65,56.39 25.65,57.15 26.16,57.66 28.19,57.66 28.45,57.4 28.45,55.12 28.83,54.74 U$2.7
  Bottom 0.254: v14.1,30.48 6.48,30.48 5.08,29.08 J2.4 | v14.1,30.48 14.48,30.48 | v18.8,46.86 18.8,52.7 v18.54,52.96 | v14.1,30.48 14.73,31.11 14.73,32.77 15.24,33.27 19.56,33.27 19.81,33.53 v19.81,33.91
SD_IN  (via drill 0.33)
  Top 0.254: IC1.5 v8.13,27.94 | v24.77,27.94 26.04,26.67 29.27,26.67 U1.SW1
  Bottom 0.254: v8.13,27.94 v24.77,27.94
SDA  (via drill 0.33)
  Top 0.254: v14.1,31.75 IC1.15 | R12.2 18.92,33.78 v18.8,33.91 17.53,35.18 17.53,38.23 16.76,38.99 16.76,46.48 v18.16,47.88 | v18.16,51.44 19.45,52.73 X1.13 23.98,52.73 24.13,52.58 24.13,51.18 24.38,50.93 30.86,50.93 31.37,51.44 U$2.5
  Bottom 0.254: J2.3 5.02,24.64 4.06,24.64 3.81,24.89 3.81,26.42 4.57,27.18 4.57,29.46 6.86,31.75 v14.1,31.75 14.1,33.53 14.48,33.91 v18.8,33.91 | v18.16,47.88 v18.16,51.44
TX_ESP  (via drill 0.33 pad 0.64)
  Top 0.254: v12.57,50.16 12.57,22.1 13.21,21.46 13.97,21.46 14.48,20.95 14.48,19.78 R2.1 | v14.86,50.16 14.86,52.58 21.34,59.05 22.68,59.05 X1.16
  Bottom 0.254: v12.57,50.16 v14.86,50.16
VBAT  (via drill 0.33, 0.33 pad 0.61)
  Top 0.254: v8.38,29.84 8.38,35.56 7.11,36.83 5.33,36.83 4.45,37.72 4.45,41.53 5.97,43.05 5.97,52.83 4.57,54.23 R6.2
  Top 0.406: J1.2 39.62,11.3 39.62,3.3 38.48,2.16 29.02,2.16 28.38,2.79 28.38,4.32 27.95,4.75 U$4.6 25.73,4.75 v25.15,5.33 | IC3.3 24.07,12.89 v24,12.95 | C8.1 18.03,12.45 18.54,12.95 v19.18,12.95
  Bottom 0.254: v8.38,29.84 7.24,29.84 6.48,29.08 6.48,22.73 8.26,20.95 13.59,20.95 14.86,19.68 14.86,13.84 15.75,12.95 v19.18,12.95
  Bottom 0.406: v19.18,12.95 v24,12.95 22.35,11.18 22.35,9.34 25.15,6.54 v25.15,5.33
VBUS  (via drill 0.33)
  Top 0.254: CHARGE.A 44.97,59.17 45.21,58.93 45.21,8.76 v43.69,7.24 | v29.08,6.99 28.15,6.05 U$4.8
  Top 0.406: U$4.8 25.95,6.05 24.07,7.93 IC3.4 24.07,9.21 C7.2 21.08,7.62 20.45,6.99 19.18,6.99 18.41,6.22 F1.2
  Bottom 0.254: v43.69,7.24 43.43,6.99 v29.08,6.99
VCC  (via drill 0.33, 0.33 pad 1.02)
  Top 0.254: RPU.4 RPU.3 RPU.2 RPU.1 | 13.4,35.36 v13.34,35.31 | R12.1 R13.1 21.5,30.9 21.84,31.24 v21.84,34.04 | R1.2 25.02,52.45 25.65,53.09 27.51,53.09 U$2.8 27.56,56.14 C10.2
  Top 0.305: CH340G.16 13.34,17.14 9.53,13.34 CH340G.4 7.49,13.34 6.35,14.48 6.35,17.02 5.59,17.78 2.54,17.78 0.83,19.49 v0.83,23.62 0.83,38.54 v0.89,38.86 v0.89,44.45 | v40.26,52.32 v40.26,39.88 40.26,35.69 v38.48,33.91 36.58,33.91 | IC1.16 13.84,33.02 13.34,33.53 v13.34,35.31 | U1.P$4 33.42,21.19 | 33.42,21.19 35.05,19.56 35.05,15.49 31.56,12 C3.1 30.73,11.05 30.55,10.86 U$9.P$5 | X1.8 C11.2 6.56,40.72 5.59,39.75 v5.59,38.73 | D1.C 36.58,33.91 | 33.42,23.6 33.42,21.19 | 24.77,32.95 v24.77,34.04 v21.84,34.04 | 36.58,33.91 TP3.TP | v26.29,56.01 26.61,56.26 C10.2
  Top 0.406: RPU.1 13.4,35.36 | 7.51,44.5 X1.8 | R15.1 C9.2 C4.1 24.77,32.95 | v33.4,23.62 33.42,23.6
  Bottom 0.254: LED3.4 4.29,55.4 4.06,55.63 2.03,55.63 1.27,54.86 1.27,45.09 v0.89,44.45 | LED4.4 4.29,41.94 4.06,42.16 1.52,42.16 0.89,42.8 | LED1.4 42.4,41.27 42.4,40.37 41.91,39.88 v40.26,39.88 | v40.26,52.32 40.64,52.32 42.42,54.1 42.42,54.69 LED2.4 | J2.2 0.64,23.69 v0.83,23.62
  Bottom 0.305: 0.89,42.8 v0.89,44.45 | v13.34,35.31 13.34,37.97 12.57,38.73 v5.59,38.73 1.02,38.73 | U$1.1 37.35,31.26 v38.48,33.91 | 13.34,35.18 13.97,35.81 20.07,35.81 v21.84,34.04 | U$1.1 26.86,33.46 26.29,34.04 v24.77,34.04 | U$1.1 26.86,28.38 29.59,25.65 31.37,25.65 v33.4,23.62 | v40.26,52.32 40.26,54.61 38.86,56.01 v26.29,56.01
  Bottom 0.406: 1.02,38.73 v0.89,38.86 | U$1.6 21.86,34.15 v21.84,34.04 | 13.34,35.18 v13.34,35.31
VREG_EN
  Top 0.254: S2.2 S2.3 38.83,62.9 39.24,62.48 40.39,62.48 41.15,61.72 41.15,35.43 39.88,34.16 39.88,13.21 39.56,12.89 39.12,12.89 38.61,12.38 38.61,8.89 38.23,8.51 36.2,8.51 35.81,8.13 35.81,7.11 35.47,6.77 R14.1 33.44,6.77 33.15,6.48 32.5,6.48 U$9.P$3
VREG_IN  (via drill 0.33)
  Top 0.254: S2.1 34.33,62.19 v34.42,62.23 | v43.43,60.71 v43.43,54.74 | v44.45,2.03 43.18,0.76 v31.11,0.76 | v31.56,4.57 C2.1
  Top 0.406: C2.1 30.42,3.37 28.38,5.41 U$4.7 | U$9.P$1 30.55,5.59 v31.56,4.57
  Bottom 0.254: v34.42,62.23 41.91,62.23 v43.43,60.71 | v43.43,54.74 45.21,52.96 45.21,2.79 v44.45,2.03 | v31.11,0.76 31.56,1.21 v31.56,4.57
VUSB
  Top 0.406: F1.1 17.14,2.41 16.38,3.17 10.92,3.17 10.13,3.97 JP1.VBUS1

### Text on the board
tNames: R3.2.3 | https://hackaday.io/ / project/26823 | Put the / ESP8266 / module / here / - / it has / all the / WIFI | ATTINY/45/85 | BC847S | - | BC847S | VBR | + | I2C | This / knows / all the / buttons | This will come / in handy / one day | BC847S | USB / serial / converter | SD | + - | 12MHz | CH340G | AP2112K | TSP2113A | JST LIPO | davedarko 2021
bNames: ON | OFF | 84x48 DOT MATRIX DISPLAY | I know I said 0.8mm before... | USB | ORDER / 1.2MM / BOARDS* | *OR THE DISPLAY WON'T FIT | GAMETOY | qwiic | A | B